# EAGLE design KG_GPS_logger (EAGLE 7.5.0)
DATABASE: ./../../../../../Components/TinyCircuits_Part_Database.txt
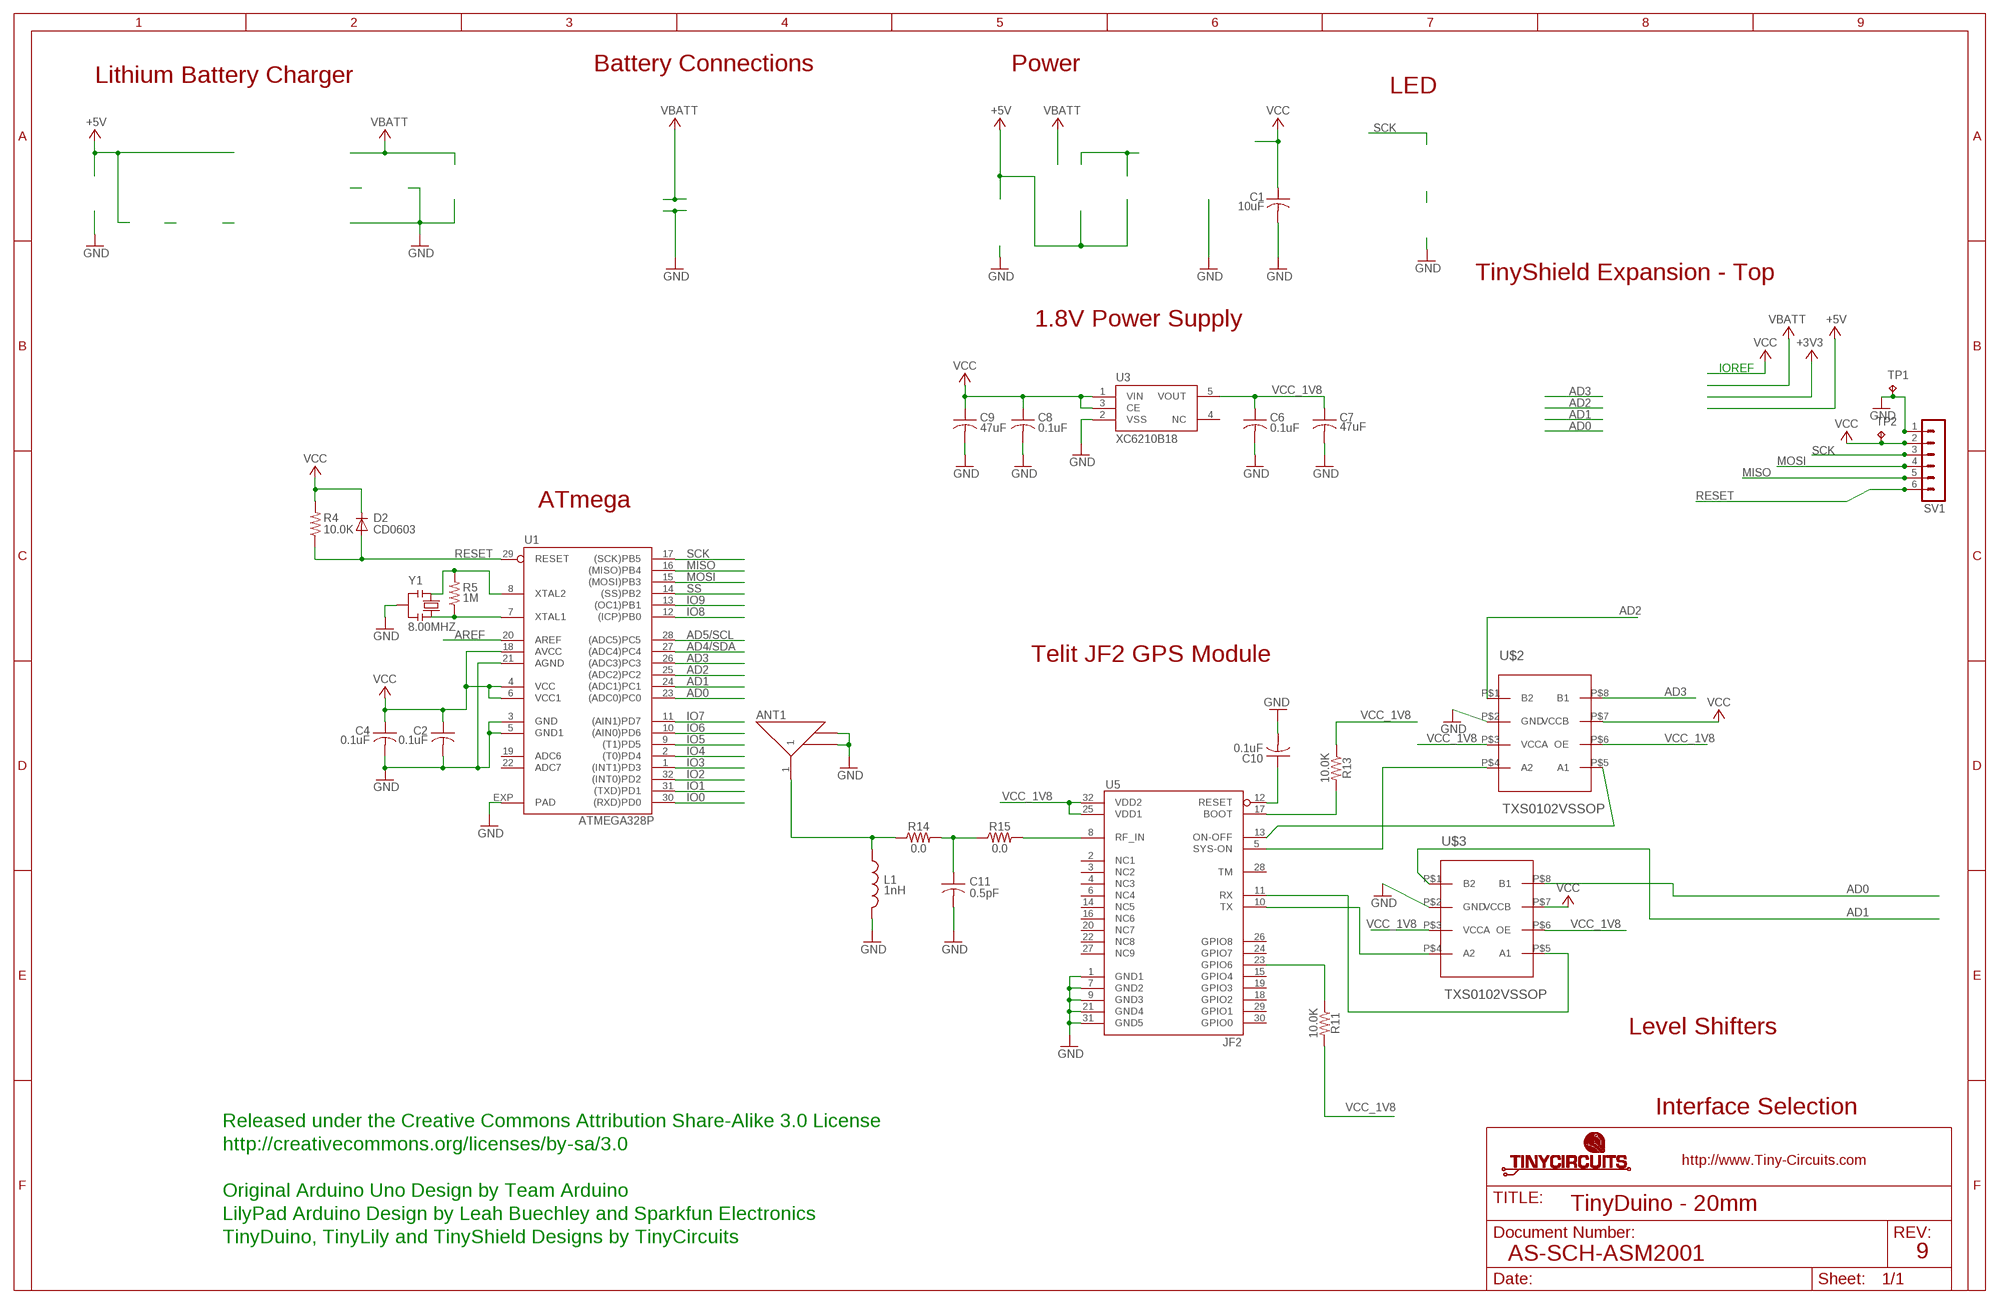
[diagram p0: schematic, sheet 1]

## Parts
ANT1  AS-ITM-00109  [W3011]
C1  10uF  AS-ITM-00002  [C0603]
C2  0.1uF  AS-ITM-00008  [C0402]
C4  0.1uF  AS-ITM-00008  [C0402]
C6  0.1uF  AS-ITM-00008  [C0402]
C7  47uF  AS-ITM-00049  [C1206]
C8  0.1uF  AS-ITM-00008  [C0402]
C9  47uF  AS-ITM-00049  [C1206]
C10  0.1uF  AS-ITM-00008  [C0402]
C11  0.5pF  AS-ITM-00126  [C0402]
D2  CD0603  AS-ITM-00009  [0603]
L1  1nH  AS-ITM-00127  [0402]
R4  10.0K  AS-ITM-00032  [0402]
R5  1M  AS-ITM-00005  [0402@1]
R11  10.0K  AS-ITM-00032  [0402]
R13  10.0K  AS-ITM-00032  [0402]
R14  0.0  AS-ITM-00076  [0402]
R15  0.0  AS-ITM-00076  [0402]
SV1  MA06-1  [MA06-1]
TP1  TPTP17SQ  [TP17SQ]
TP2  TPTP17SQ  [TP17SQ]
U1  ATMEGA328P  AS-ITM-00013MU  [ATMEL_QFN32]
U3  XC6210B18  AS-ITM-00075  [SOT-25]
U5  JF2  AS-ITM-00077  [JF2]
U$2  TXS0102VSSOP  [VSSOP_3MM]
U$3  TXS0102VSSOP  [VSSOP_3MM]
Y1  8.00MHZ  AS-ITM-00027B  [RESONATOR_SMALL]

## Nets
AD0: U1.23((ADC0)PC0) U$3.P$8(B1)
AD1: U1.24((ADC1)PC1) U$3.P$1(B2)
AD2: U1.25((ADC2)PC2) U$2.P$1(B2)
AD3: U1.26((ADC3)PC3) U$2.P$8(B1)
AD4/SDA: U1.27((ADC4)PC4)
AD5/SCL: U1.28((ADC5)PC5)
AREF: U1.20(AREF)
GND: ANT1.2(G1) ANT1.3(G2) C1.2 C2.2 C4.2 C6.2 C7.2 C8.2 C9.2 C10.2 C11.2 L1.2 SV1.1 TP1.TP U1.3(GND) U1.5(GND1) U1.21(AGND) U1.EXP(PAD) U3.2(VSS) U5.1(GND1) U5.7(GND2) U5.9(GND3) U5.21(GND4) U5.31(GND5) U$3.P$2(GND) Y1.2
IO0: U1.30((RXD)PD0)
IO1: U1.31((TXD)PD1)
IO2: U1.32((INT0)PD2)
IO3: U1.1((INT1)PD3)
IO4: U1.2((T0)PD4)
IO5: U1.9((T1)PD5)
IO6: U1.10((AIN0)PD6)
IO7: U1.11((AIN1)PD7)
IO8: U1.12((ICP)PB0)
IO9: U1.13((OC1)PB1)
MISO: SV1.5 U1.16((MISO)PB4)
MOSI: SV1.4 U1.15((MOSI)PB3)
N$1: R5.2 U1.8(XTAL2) Y1.1
N$3: R5.1 U1.7(XTAL1) Y1.3
N$8: R11.1 U5.23(GPIO6)
N$11: ANT1.1 L1.1 R14.1
N$12: R13.2 U5.17(BOOT)
N$13: U5.13(ON-OFF) U$2.P$5(A1)
N$14: U5.5(SYS-ON) U$2.P$4(A2)
N$16: U5.11(RX) U$3.P$5(A1)
N$17: U5.10(TX) U$3.P$4(A2)
N$18: C10.1 U5.12(RESET)
N$19: C11.1 R14.2 R15.1
N$20: R15.2 U5.8(RF_IN)
RESET: D2.A R4.1 SV1.6 U1.29(RESET)
SCK: SV1.3 U1.17((SCK)PB5)
SS: U1.14((SS)PB2)
VCC: C1.1 C2.1 C4.1 C8.1 C9.1 D2.C R4.2 SV1.2 TP2.TP U1.4(VCC) U1.6(VCC1) U1.18(AVCC) U3.1(VIN) U3.3(CE) U$2.P$7(VCCB) U$3.P$7(VCCB)
VCC_1V8: C6.1 C7.1 R11.2 R13.1 U3.5(VOUT) U5.25(VDD1) U5.32(VDD2) U$2.P$3(VCCA) U$2.P$6(OE) U$3.P$3(VCCA) U$3.P$6(OE)
Unconnected: U1.19(ADC6) U1.22(ADC7) U3.4(NC) U5.2(NC1) U5.3(NC2) U5.4(NC3) U5.6(NC4) U5.14(NC5) U5.15(GPIO4) U5.16(NC6) U5.18(GPIO2) U5.19(GPIO3) U5.20(NC7) U5.22(NC8) U5.24(GPIO7) U5.26(GPIO8) U5.27(NC9) U5.28(TM) U5.29(GPIO1) U5.30(GPIO0)

## Notes on the sheet
- Battery Connections | Power
- Lithium Battery Charger
- LED
- TinyShield Expansion - Top
- 1.8V Power Supply
- IOREF
- ATmega
- Telit JF2 GPS Module
- Level Shifters
- Interface Selection
- Released under the Creative Commons Attribution Share-Alike 3.0 License
- http://creativecommons.org/licenses/by-sa/3.0
- Original Arduino Uno Design by Team Arduino
- TinyDuino - 20mm
- LilyPad Arduino Design by Leah Buechley and Sparkfun Electronics
- TinyDuino, TinyLily and TinyShield Designs by TinyCircuits
- AS-SCH-ASM2001 | 9

## Power pins joined to a net without a drawn wire
GND: U$2.P$2(GND)

## Library data of the parts
ANT1 = tinycircuits:AS-ITM-00109: ANTENNA GPS CERAMIC 1.575GHZ; PARTNO: AS-ITM-00109; VALUE: W3011A
C1 = tinycircuits:AS-ITM-00002: CAP CER 10UF 10V 20% X5R 0603; PARTNO: AS-ITM-00002
C2 C4 C6 C8 C10 = tinycircuits:AS-ITM-00008: CAP CER 0.1UF 16V 10% X5R 0402; PARTNO: AS-ITM-00008
C7 C9 = tinycircuits:AS-ITM-00049: CAP CER 47UF 6.3V 20% X6S 1206; PARTNUM: AS-ITM-00049
C11 = tinycircuits:AS-ITM-00126: CAP CER 0.5PF 16V 0.1% 0402
D2 = tinycircuits:AS-ITM-00009: Diodes (General Purpose, Power, Switching) IO=150mA VR=75V HIGH SPEED; PARTNO: AS-ITM-00009
L1 = tinycircuits:AS-ITM-00127: INDUCTOR 1NH
R4 R11 R13 = tinycircuits:AS-ITM-00032: RES 10.0K OHM 1/16W 1% 0402 SMD; PARTNO: AS-ITM-00032
R5 = tinycircuits:AS-ITM-00005: RES 1.00M OHM 1/16W 1% 0402; PARTNO: AS-ITM-00005; VALUE: 1.00M
R14 R15 = tinycircuits:AS-ITM-00076: RES 0.0 OHM 1/16W 1% 0402 SMD; PARTNO: AS-ITM-00076
SV1 = con-lstb:MA06-1: PIN HEADER; OC_FARNELL: unknown; OC_NEWARK: unknown
TP1 TP2 = testpad:TP: Test pad
U1 = tinycircuits:AS-ITM-00013: MCU AVR 32K FLASH 32-QFN; PARTNO: AS-ITM-00013; VALUE: ATMEGA328P-MU
U3 = tinycircuits:AS-ITM-00075: IC REG LDO 1.8V .7A SOT-25; PARTNO: AS-ITM-00075
U5 = tinycircuits:AS-ITM-00077: Telit JF2 GPS Module; PARTNO: AS-ITM-00077
U$2 U$3 = tucow:TXS0102
Y1 = tinycircuits:AS-ITM-00027: CER RESONATOR 8.00MHZ SMD; PARTNO: AS-ITM-00027

## Board
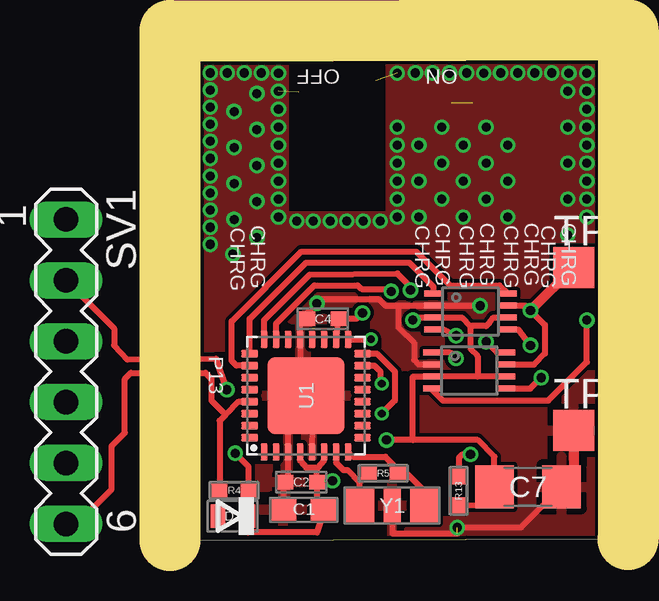
[diagram p1: board, top side]
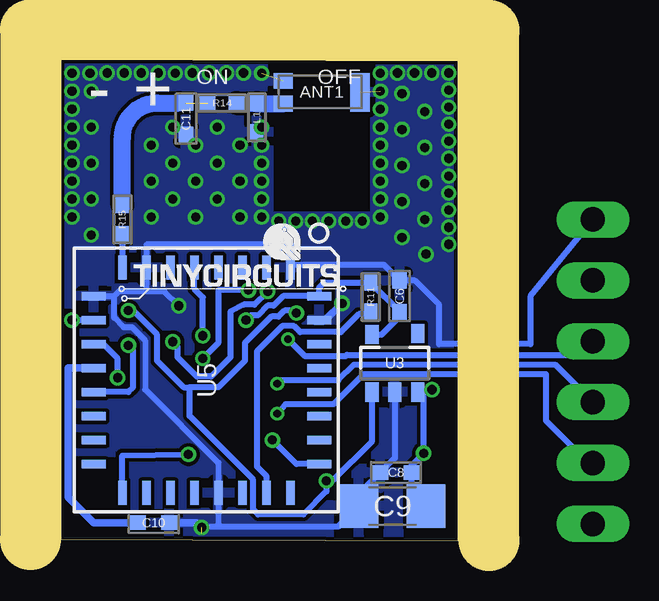
[diagram p2: board, bottom side, seen from below]

Size 16.6 x 20.05 mm. Coordinates in mm from the lower left corner, seen from the top.
Outline: 0,20 16.6,20.05 16.6,0.05 0,0 0,20
Copper layers (1*16): Top 0.035mm / dielectric 1.5mm / Bottom 0.035mm
Design rules "default *": minimum track width 8mil, minimum drill 15mil, track to track 6mil, track to pad 6mil, pad to pad 6mil, via to via 6mil, smd to smd 6mil, copper to edge 6mil, drill to drill 8mil, minimum pad ring 8mil, minimum via ring 5mil, stop-mask expansion 4mil, vias tented up to drill 25mil, thermal gap 10mil
tRestrict: area 3.7,13.8 to 7.7,20
bRestrict: area 3.7,13.8 to 7.7,20
Milling: 3 lines

### Footprints (pad centres in the part's own frame; a part is rotated, then mirrored left to right if it is on the bottom)
W3011 = smd 0.8 x 0.65: 1 1.6,0.475; 2 1.6,-0.475 | smd 0.8 x 1.6: 3 -1.6,0
C0603 = smd 1.1 x 1: 1 -0.85,0; 2 0.85,0
C0402 = smd 0.65 x 0.6: 1 -0.65,0; 2 0.65,0
C1206 = smd 1.6 x 1.8: 1 -1.4,0; 2 1.4,0
0603 = smd 0.61 x 0.991: A 0.622,0; C -0.622,0
0402 = smd 0.65 x 0.55: 1 -0.6,0; 2 0.6,0
0402@1 = smd 0.65 x 0.55: 1 -0.6,0; 2 0.6,0
MA06-1 = drill 1.016 long: 1 -6.35,0; 2 -3.81,0; 3 -1.27,0; 4 1.27,0; 5 3.81,0; 6 6.35,0
TP17SQ = smd 1.7 x 1.7: TP 0,0
ATMEL_QFN32 = smd 0.711 x 0.305: 1 -2.351,1.75; 2 -2.351,1.25; 3 -2.351,0.75; 4 -2.351,0.25; 5 -2.351,-0.25; 6 -2.351,-0.75; 7 -2.351,-1.25; 8 -2.351,-1.75; 17 2.351,-1.75; 18 2.351,-1.25; 19 2.351,-0.75; 20 2.351,-0.25; 21 2.351,0.25; 22 2.351,0.75; 23 2.351,1.25; 24 2.351,1.75 | smd 0.305 x 0.711: 9 -1.75,-2.351; 10 -1.25,-2.351; 11 -0.75,-2.351; 12 -0.25,-2.351; 13 0.25,-2.351; 14 0.75,-2.351; 15 1.25,-2.351; 16 1.75,-2.351; 25 1.75,2.351; 26 1.25,2.351; 27 0.75,2.351; 28 0.25,2.351; 29 -0.25,2.351; 30 -0.75,2.351; 31 -1.25,2.351; 32 -1.75,2.351 | smd 3.2 x 3.2: EXP 0,0
SOT-25 = smd 0.55 x 0.8: 1 -0.95,-1.2; 2 0,-1.2; 3 0.95,-1.2; 4 0.95,1.25; 5 -0.95,1.2
JF2 = smd 1 x 0.35: 1 -4.7,3.5; 2 -4.7,2.5; 3 -4.7,1.5; 4 -4.7,0.5; 5 -4.7,-0.5; 6 -4.7,-1.5; 7 -4.7,-2.5; 8 -4.7,-3.5; 17 4.7,-3.5; 18 4.7,-2.5; 19 4.7,-1.5; 20 4.7,-0.5; 21 4.7,0.5; 22 4.7,1.5; 23 4.7,2.5; 24 4.7,3.5 | smd 0.35 x 1: 9 -3.5,-4.7; 10 -2.5,-4.7; 11 -1.5,-4.7; 12 -0.5,-4.7; 13 0.5,-4.7; 14 1.5,-4.7; 15 2.5,-4.7; 16 3.5,-4.7; 25 3.5,4.7; 26 2.5,4.7; 27 1.5,4.7; 28 0.5,4.7; 29 -0.5,4.7; 30 -1.5,4.7; 31 -2.5,4.7; 32 -3.5,4.7
VSSOP_3MM = smd 0.25 x 0.75: P$1 -0.75,-1.55; P$2 -0.25,-1.55; P$3 0.25,-1.55; P$4 0.75,-1.55; P$5 0.75,1.55; P$6 0.25,1.55; P$7 -0.25,1.55; P$8 -0.75,1.55
RESONATOR_SMALL = smd 1.2 x 1.5: 1 -1.35,0; 3 1.35,0 | smd 0.7 x 1.5: 2 0,0

### Placement (x,y rotation side)
ANT1  5.7,18.7 180 bottom
C1  4.3,1.3 180 top
C2  4.2,2.45 180 top
C4  5.1,9.25 180 top
C6  2.45,10.2 90 bottom
C7  13.65,2.25 0 top
C8  2.6,2.85 180 bottom
C9  2.75,1.45 180 bottom
C10  12.7,0.75 0 bottom
C11  11.35,17.6 270 bottom
D2  1.35,1.03 180 top
L1  8.4,17.65 270 bottom
R4  1.4,2.1 0 top
R5  7.62,2.81 0 top
R11  3.65,10.17 90 bottom
R13  10.76,2.09 90 top
R14  9.85,18.25 180 bottom
R15  14,13.4 270 bottom
SV1  -5.6,7.05 270 top  (outside the outline)
TP1  15.55,4.6 0 top
TP2  15.55,11.4 0 top
U1  4.4,6.05 90 top
U3  2.65,7.4 0 bottom
U5  10.5,6.7 270 bottom
U$1  [DOCFIELD-TINYCIRCUITS-PCB]  34,-10 0 top  (outside the outline)
U$2  11.25,9.55 270 top
U$3  11.2,7.1 270 top
Y1  7.99,1.47 180 top

### Tracks (layer width: path | path; a pad name or v marks a point on that pad's centre or on a via)
AD0  (via drill 0.38)
  Top 0.254: U$3.P$8 12.35,7.85 v11.9,8.3 | U1.23 3.15,9.05 4.75,10.65 6.55,10.65 6.7,10.5 7.85,10.5 arc-90 v7.95,10.4
  Bottom 0.254: v7.95,10.4 8.5,9.85 8.95,9.85 9.5,9.55 9.5,7.65 10.3,6.85 10.9,6.85 11.7,7.65 11.7,8.1 v11.9,8.3
AD1  (via drill 0.38)
  Top 0.254: U$3.P$1 10.4,7.85 v10.65,7.6 | U1.24 2.65,9.2 4.55,11.1 8.2,11.15 8.75,10.6 v8.75,10.45
  Bottom 0.254: v8.75,10.45 10,10.45 10,8.25 v10.65,7.6
AD2
  Top 0.254: U1.25 2.05,8.3 2.05,9.25 4.4,11.6 8.7,11.6 9.7,10.6 U$2.P$1
AD3
  Top 0.254: U1.26 1.5,7.3 1.3,7.5 1.3,9.15 4.2,12.05 9,12.05 10.4,10.65 12.45,10.65 U$2.P$8
GND  (via drill 0.38)  (3 unrouted)
  Top 0.254: U1.EXP 3.65,6.05 U1.3 3.65,2.55 C2.2 3.45,2.35 C1.2 3.55,1.45 | U1.5 4.7,6.05 U1.EXP | U1.EXP 4.15,6.3 U1.21 4.15,9.2 C4.2 4.45,9.5 v4.85,9.9 5,10.05 7.45,10.05 7.7,9.8 8.25,9.8 | v11.65,9.8 U$2.P$2 8.25,9.8 | v10.7,0.55 13.35,0.55 C7.2 | Y1.2 8,0.3 10.7,0.3 | 8.25,9.8 8.25,8.9 8.9,8.25 8.9,7.55 9.1,7.35 U$3.P$2
  Top 0.406: TP1.TP 15.55,2.75 C7.2
  Bottom 0.254: U5.9 14.35,10.2 | v10.7,0.55 10.65,0.6 10.05,0.6 | 10.05,0.6 5,0.6 C9.2 4.15,1.95 C8.2 2.65,3.45 U3.2 | 10.05,0.6 10,0.65 U5.21 10,3.25 13.05,6.3 13.05,8.35 13.6,8.9 13.95,8.9 14.35,9.3 14.35,10.2 | 7,11.5 3.1,11.5 C6.2 1.8,10.85 0.8,9.85 0.8,8.2 -3,8.2 -3,10.2 SV1.1 | 7,11.5 U5.1 | 7,11.5 7,12.35 13,12.35 U5.7 13,10.4 | 13,10.4 14.15,10.4 14.35,10.2 | v11.65,9.8 12.25,10.4 13,10.4
  Bottom 0.305: C10.2 10.9,0.75 v10.7,0.55 | U5.31 5.55,9.2 v4.85,9.9
  other vias: 1.4,16.4 1.4,14.9 0.41,18.8 0.41,18.08 0.41,17.37 0.41,16.66 7.49,13.33 0.41,15.94 0.41,15.21 0.41,14.5 0.41,13.78 0.41,13.07 0.41,12.36 6.78,13.33 6.09,13.33 5.41,13.33 4.69,13.33 4.01,13.33 2.35,14.15 2.35,12.65 1.4,13.4 1.35,11.95 3.25,15 3.25,14.25 3.25,13.5 3.25,17.25 3.25,16.5 3.25,15.75 2.35,15.65 2.35,18.65 2.35,17.15 1.4,17.9 3.25,19.5 3.25,18.75 3.25,18 0.4,19.51 1.12,19.51 1.83,19.51 2.54,19.51 8.2,15 8.2,14.25 8.2,13.5 8.2,17.25 8.2,16.5 8.2,15.75 8.2,19.5 9.1,16.5 9.1,15 9.1,13.5 10.95,16.5 10.95,15 10.95,13.5 10.05,14.25 10.05,17.25 10.05,15.75 11.9,17.25 11.9,15.75 12.8,16.5 12.8,15 11.9,14.25 12.8,13.5 15.3,14.25 15.3,12.75 15.3,15.75 15.3,18.75 15.3,17.25 16.1,15 16.1,14.25 16.1,13.5 16.1,17.25 16.1,16.5 16.1,15.75 16.1,19.5 16.1,18.75 16.1,18 12.5,19.51 13.22,19.51 13.93,19.51 14.64,19.51 15.35,19.5 8.95,19.51 9.67,19.51 10.38,19.51 11.09,19.51 11.8,19.5
  pour Top: -1.2,20.3 17.1,20.3 17.65,-1.15 -0.9,-0.85
  pour Bottom: -0.6,20.8 17.15,20.3 17.05,-0.6 -0.8,-0.55
MISO  (via drill 0.32)
  Top 0.254: U1.16 7.35,7.8 8.1,7.05 8.1,5.85 v7.55,5.3
  Bottom 0.254: v7.55,5.3 7.2,5.7 5.2,5.7 3.95,6.95 -3.65,6.95 -3.65,5 -5.41,3.24 SV1.5
MOSI  (via drill 0.32)
  Top 0.254: U1.15 7.25,7.3 7.5,7.05 7.5,6.65 v7.55,6.55
  Bottom 0.254: v7.55,6.55 7.45,6.7 5,6.7 4.35,7.35 -4.03,7.35 SV1.4
N$1
  Top 0.254: Y1.1 9.34,2.05 8.59,2.81 R5.2 8.22,2.98 7.7,3.5 6.35,3.5 U1.8
N$3
  Top 0.254: Y1.3 6.64,2.44 | 6.64,2.44 R5.1 | U1.7 5.65,3.25 5.95,2.95 6.13,2.95 6.64,2.44
N$8
  Bottom 0.254: U5.23 8,2.7 8.4,3.1 8.4,7.9 7.35,8.95 6.85,8.95 6.6,8.7 4.9,8.7 4.15,9.45 3.77,9.45 R11.1
N$11
  Bottom 0.7: R14.1 L1.1 arc-90 8.38,18.23 ANT1.1
N$12  (via drill 0.38)
  Top 0.254: v11.25,3.6 10.9,3.6 10.77,3.46 R13.2
  Bottom 0.254: U5.17 14,3.55 v11.25,3.6
N$13  (via drill 0.38)
  Top 0.254: U$2.P$5 13.25,8.8 v13.75,8.15
  Bottom 0.254: 15.2,6.18 U5.13 13.75,6.2 13.55,6.4 13.55,7.95 v13.75,8.15
N$14  (via drill 0.38)
  Top 0.254: U$2.P$4 10.15,8.8 v10.65,8.55
  Bottom 0.254: 11,11 U5.5 11,10.5 10.65,10.15 v10.65,8.55
N$16  (via drill 0.38)
  Top 0.254: U$3.P$5 13.75,6.35 v14.2,6.8
  Bottom 0.254: v14.2,6.8 14.2,7.6 14.8,8.2 U5.11
N$17  (via drill 0.38)
  Top 0.254: U$3.P$4 9.6,6.35 10.1,5.85 14.5,5.85 16.1,7.45 v16.1,9.2
  Bottom 0.254: v16.1,9.2 U5.10
N$18
  Bottom 0.305: U5.12 16.25,7.2 16.25,1.8 15.2,0.75 C10.1
N$19  (1 unrouted)
  Bottom 0.406: 11.65,18.25 C11.1
  Bottom 0.7: R15.1 14,16.8 arc90 12.55,18.25 11.65,18.25
N$20
  Bottom 0.254: R15.2 | R15.2 U5.8
RESET
  Top 0.254: D2.A 0.8,1.1 R4.1 0.8,5 1.05,5.25 | U1.29 1.6,5.8 1.05,5.25 | SV1.6 -5.15,0.7 -3.7,2.15 -3.7,3.95 -3.15,4.5 -3.15,6.75 -2.9,7 0.2,7 0.45,6.75 0.45,5.85 1.05,5.25
SCK  (via drill 0.32)
  Top 0.254: U1.17 v7.1,8.4
  Bottom 0.254: v7.1,8.4 6.4,7.7 4.7,7.7 4.65,7.75 -5.03,7.75 SV1.3
VCC  (via drill 0.38)
  Top 0.254: U1.4 4.15,3.35 4.27,3.2 4.4,3.05 4.9,3.05 | 4.9,3.05 5.15,3.35 U1.6 | v6.75,9.5 6.5,9.25 C4.1 arc-90 5.75,9.05 U1.18 | C2.1 4.85,1.6 arc90 C1.1 4.85,0.35 1.97,0.35 D2.C 2,1.05 R4.2 2,3.1 v1.45,3.65 | C2.1 5.45,2.45 v5.5,2.5 | C2.1 4.85,3 4.9,3.05 | U$3.P$7 13.9,7.35 14.35,7.8 14.35,9 v13.75,9.6 13.55,9.8 U$2.P$7 | v1.1,6.3 0.65,7.6 -3.05,7.55 -3.6,8.15 -3.6,8.86 SV1.2
  Top 0.406: TP2.TP v13.75,9.6
  Bottom 0.254: 11.2,6.4 11.2,5.2 8.55,2.55 8.55,1.3 8.35,1.1 6.45,1.1 5.5,2.05 v5.5,2.5 5.25,2.5 3.6,4.15 U3.1 | 11.2,6.4 11.45,6.4 12.55,7.5 12.55,8.6 13.55,9.6 v13.75,9.6 | v1.1,6.3 1.25,6.2 U3.3 arc90 1.45,5.95 v1.45,3.65 1.95,3.15 C8.1 1.95,2.05 C9.1 | v6.75,9.5 6.85,9.6 7.25,9.6 7.5,9.35 7.8,9.35 8.9,8.25 8.9,7.5 10,6.4 11.2,6.4
VCC_1V8  (via drill 0.38)
  Top 0.254: R13.1 12.16,1.5 12.16,2.15 C7.1 12.25,3.5 11.55,4.2 8.85,4.2 | 11.25,8.95 10.9,9.3 U$2.P$3 9,9.3 v8.85,9.2 | U$2.P$6 12.2,9.3 12.05,9.1 11.9,8.95 11.25,8.95 | U$3.P$6 11.55,6.85 | 11.55,6.85 U$3.P$3 8.85,6.85 8.85,4.2 | 8.85,4.2 v7.75,4.2 | 11.25,8.95 11.25,8 11.55,7.7 11.55,6.85
  Bottom 0.254: U3.5 3.2,8.6 2.45,9.35 C6.1 3.65,10.75 R11.2 5.58,10.77 5.8,10.55 U5.32 7.3,10.2 7.7,9.8 7.95,9.8 8.35,9.4 8.65,9.4 v8.85,9.2 | U5.25 6.75,3.2 v7.75,4.2

### Text on the board
tPlace: OFF | ON | CHRG | CHRG | CHRG | CHRG | CHRG | CHRG | CHRG | CHRG | CHRG | CHRG | P13
bPlace: OFF | ON | + | -
Document: FABRICATION DRAWING | NOTES: | 1. PRINTED CIRCUIT BOARD MADE FROM NEMA GRADE FR-4 EPOXY LAMINATE | WITH 1 OUNCE COPPER PLATING AND .024 THICKNESS. | 2. ALL DIMENSIONS ARE GIVEN IN INCHES. | 3. CIRCUIT PATHS ARE FOR REFERENCE ONLY. | 4. HOLE SIZES SHOWN ARE FINISHED DIAMETERS AFTER PLATING. | 5. BOARD PLATED USING REFLOW OR SIMILAR METHOD. | 6. BOARD TO HAVE BLUE SOLDER MASK ON PLATED SURFACES USING WET FILM | 7. SILKSCREEN BOARD USING WHITE INK. | SR100 OR SR1010 EPOXY. EQUIVALENT WET OR DRY FILM MAY BE USED. | 8. THE FOLLOWING INFORMATION APPLIES TO THIS BOARD: | * 2 COPPER LAYERS | * .024 BOARD THICKNESS | * REQUIRES TOP SIDE SILKSCREEN | Released under the Creative Commons Attribution Share-Alike 3.0 License | http://creativecommons.org/licenses/by-sa/3.0 | LilyPad Arduino Design by Leah Buechley and Sparkfun Electronics | Original Arduino Uno Design by Team Arduino | TinyDuino, TinyLily and TinyShield Designs by TinyCircuits | TinyDuino - 20mm | AS-PCB-ASM2001 | 9